# EAGLE design untitled (EAGLE 4.16)
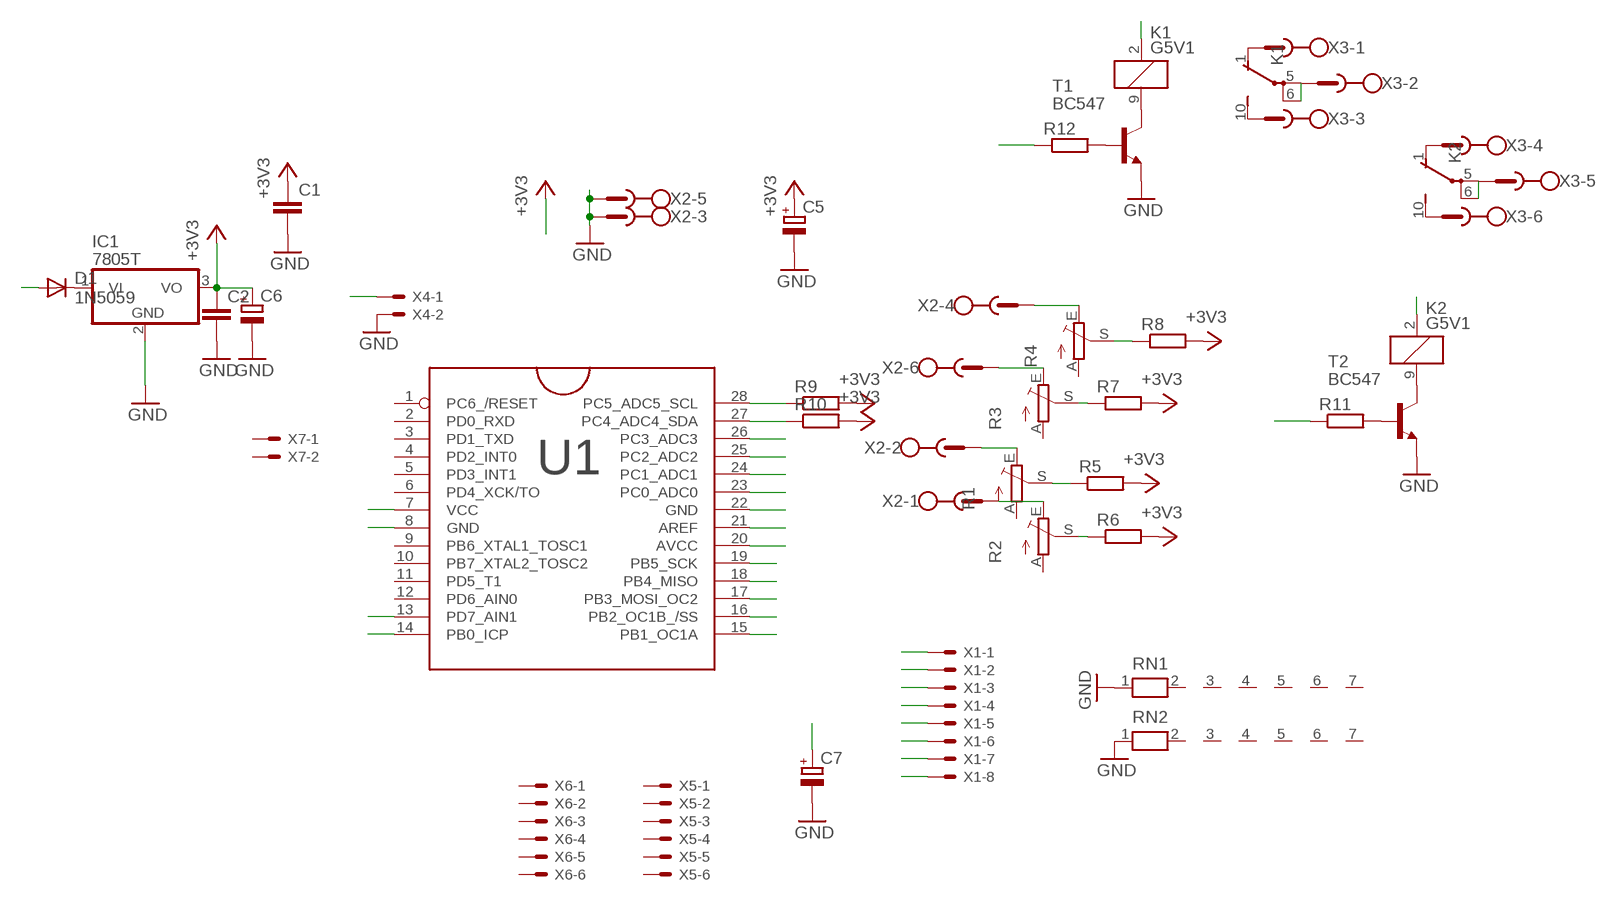
[diagram p0: schematic, sheet 1]

## Parts
C1  C-EU050-024X044  [C050-024X044]
C2  C-EU050-024X044  [C050-024X044]
C5  CPOL-EUE2.5-7  [E2,5-7]
C6  CPOL-EUE2.5-7  [E2,5-7]
C7  CPOL-EUE2.5-7  [E2,5-7]
D1  1N5059  [DO204-10]
IC1  7805T  [TO220H]
K1  G5V1  [G5V1]
K2  G5V1  [G5V1]
R1  TRIM_EU-S63X  [S63X]
R2  TRIM_EU-S63X  [S63X]
R3  TRIM_EU-S63X  [S63X]
R4  TRIM_EU-S63X  [S63X]
R5  R-EU_M0805  [M0805]
R6  R-EU_M0805  [M0805]
R7  R-EU_M0805  [M0805]
R8  R-EU_M0805  [M0805]
R9  R-EU_M0805  [M0805]
R10  R-EU_M0805  [M0805]
R11  R-EU_M0805  [M0805]
R12  R-EU_M0805  [M0805]
RN1  RN06  [RN-7]
RN2  RN06  [RN-7]
T1  BC547  [TO92]
T2  BC547  [TO92]
U1  ATMEGA8_PDIP28_PDIP  [DIL-28-3]
X1  22-23-2081  [22-23-2081]
X2  RIA182-06  [RIA182-06]
X3  RIA182-06  [RIA182-06]
X4  22-23-2021  [22-23-2021]
X5  22-23-2061  [22-23-2061]
X6  22-23-2061  [22-23-2061]
X7  22-23-2021  [22-23-2021]

## Nets
+3V3: C1.1 C2.1 C5.+ C6.+ IC1.3(VO) R5.2 R6.2 R7.2 R8.2 R9.2 R10.2 U1.7(VCC) U1.20(AVCC) U1.21(AREF) X1.1
ADC0: R2.E U1.23(PC0_ADC0) X2.1
ADC1: R1.E U1.24(PC1_ADC1) X2.2
ADC2: R4.E U1.25(PC2_ADC2) X2.4
ADC3: R3.E U1.26(PC3_ADC3) X2.6
DC: U1.15(PB1_OC1A) X1.4
ENA: U1.16(PB2_OC1B_/SS) X1.5
GND: C1.2 C2.2 C5.- C6.- C7.- IC1.2(GND) RN1.1 RN2.1 T1.1(E) T2.1(E) U1.8(GND) U1.22(GND) X1.6 X2.3 X2.5 X4.2
N$1: R1.S R5.1
N$2: R2.S R6.1
N$3: R3.S R7.1
N$4: R4.S R8.1
N$5: D1.C IC1.1(VI)
N$6: K1.1(2:O) X3.1
N$7: K1.5(2:P) K1.6(2:P) X3.2
N$8: K1.10(2:S) X3.3
N$9: K2.1(2:O) X3.4
N$11: K2.5(2:P) K2.6(2:P) X3.5
N$12: K2.10(2:S) X3.6
N$13: R9.1 U1.28(PC5_ADC5_SCL)
N$14: R10.1 U1.27(PC4_ADC4_SDA)
N$15: K1.9 T1.3(C)
N$16: K2.9 T2.3(C)
N$17: R11.2 T2.2(B)
N$18: R12.2 T1.2(B)
POW: D1.A K1.2 K2.2 X4.1
REL1: R12.1 U1.14(PB0_ICP)
REL2: R11.1 U1.13(PD7_AIN1)
RES: U1.18(PB4_MISO) X1.8
SCK: U1.19(PB5_SCK) X1.2
SDIN: U1.17(PB3_MOSI_OC2) X1.3
VOUT: C7.+ X1.7
Unconnected: R1.A R2.A R3.A R4.A RN1.2 RN1.3 RN1.4 RN1.5 RN1.6 RN1.7 RN2.2 RN2.3 RN2.4 RN2.5 RN2.6 RN2.7 U1.1(PC6_/RESET) U1.2(PD0_RXD) U1.3(PD1_TXD) U1.4(PD2_INT0) U1.5(PD3_INT1) U1.6(PD4_XCK/TO) U1.9(PB6_XTAL1_TOSC1) U1.10(PB7_XTAL2_TOSC2) U1.11(PD5_T1) U1.12(PD6_AIN0) X5.1 X5.2 X5.3 X5.4 X5.5 X5.6 X6.1 X6.2 X6.3 X6.4 X6.5 X6.6 X7.1 X7.2

## Library data of the parts
C1 C2 = rcl:C-EU: CAPACITOR, European symbol
C5-C7 = rcl:CPOL-EU: POLARIZED CAPACITOR, European symbol
D1 = diode:1N5059: DIODE controlled avalanche rectifier
IC1 = linear:78*: Positive VOLTAGE REGULATOR Source: http://cache.national.com/ds/LM/LM78L05.pdf http://www.fairchildsemi.com/ds/LM/LM7805.pdf
K1 K2 = relay:G5V1: RELAY 1 x switch, 0.5 A/125 V AC, 1 A/24 V DC , Omron
R1-R4 = pot:TRIM_EU-: POTENTIOMETER
R5-R12 = rcl:R-EU_: RESISTOR, European symbol
RN1 RN2 = resistor-net:RN06: RESISTOR NETWORK
T1 T2 = transistor:BC547: NPN TRANSISTOR
U1 = atmel_prototype_header:ATMEGA8_PDIP28: ATMEL 8-bit AVR Microcontroller with 8K Bytes In-System Programmable Flash.
X1 = con-molex:22-23-2081: .100" (2.54mm) Center Header - 8 Pin
X2 X3 = con-ria182:RIA182-06: Gewinkelter Wannenstecker 6-polig Rastermaß: 3,5mm Lötstift / Steckerstift: 1x1mm Bohrung: 1,5mm Bemessungsstrom: 5A Nennquerschnitt Stecker: 1,5qmm eindrähtig / 1qmm feinstdrähtig
X4 X7 = con-molex:22-23-2021: .100" (2.54mm) Center Header - 2 Pin
X5 X6 = con-molex:22-23-2061: .100" (2.54mm) Center Header - 6 Pin

## Board
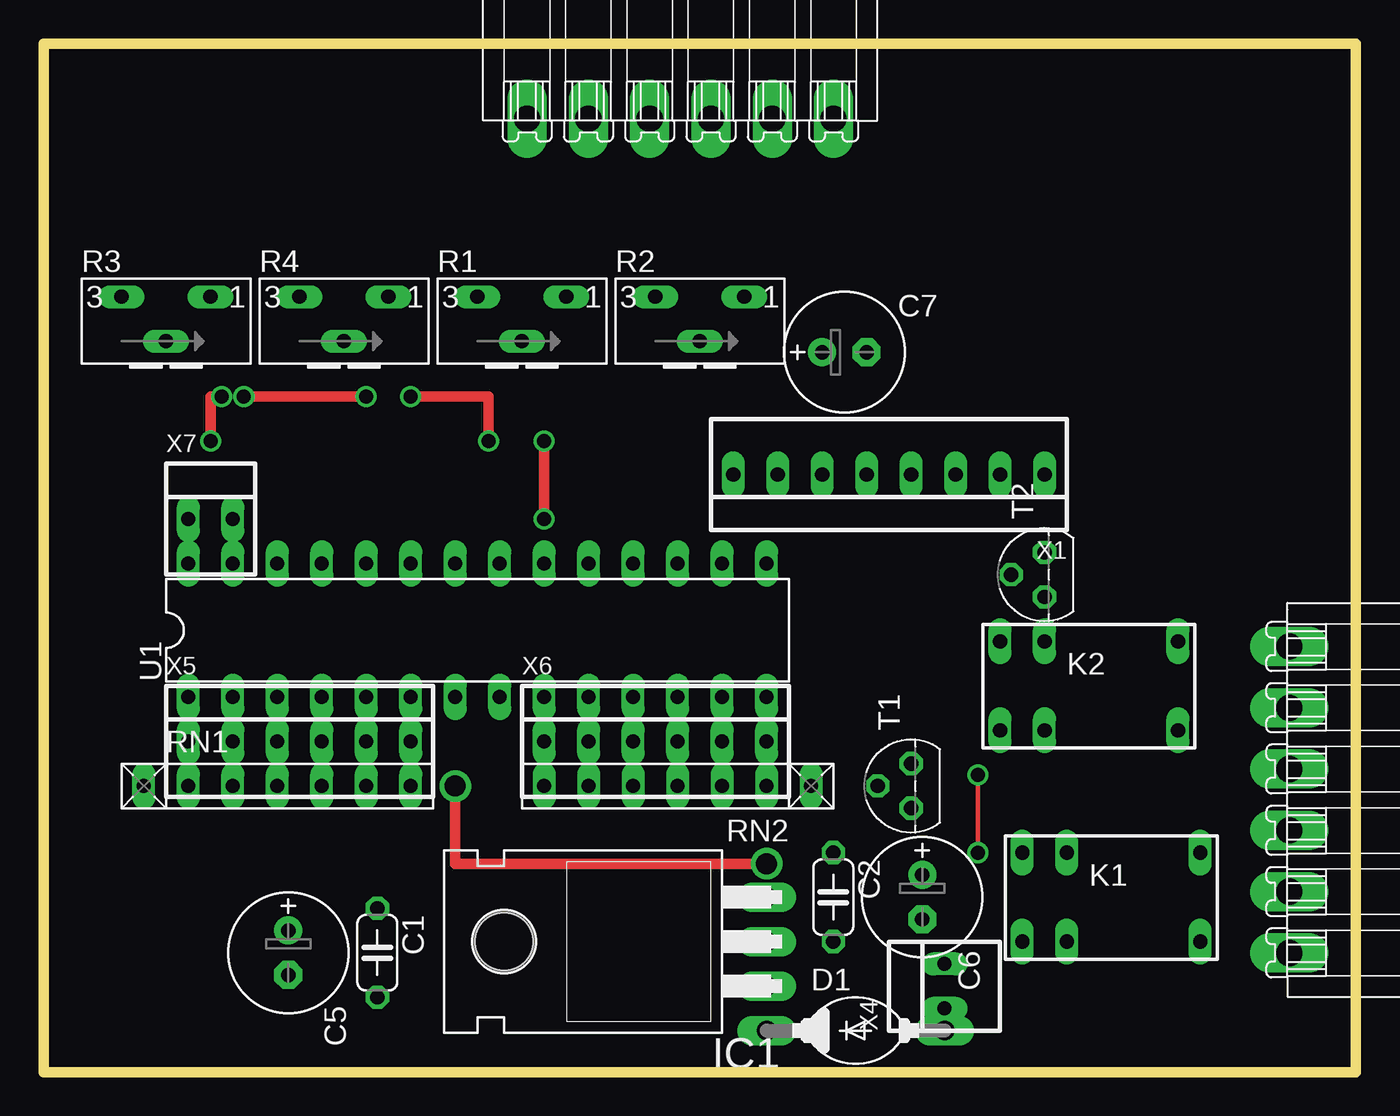
[diagram p1: board, top side]
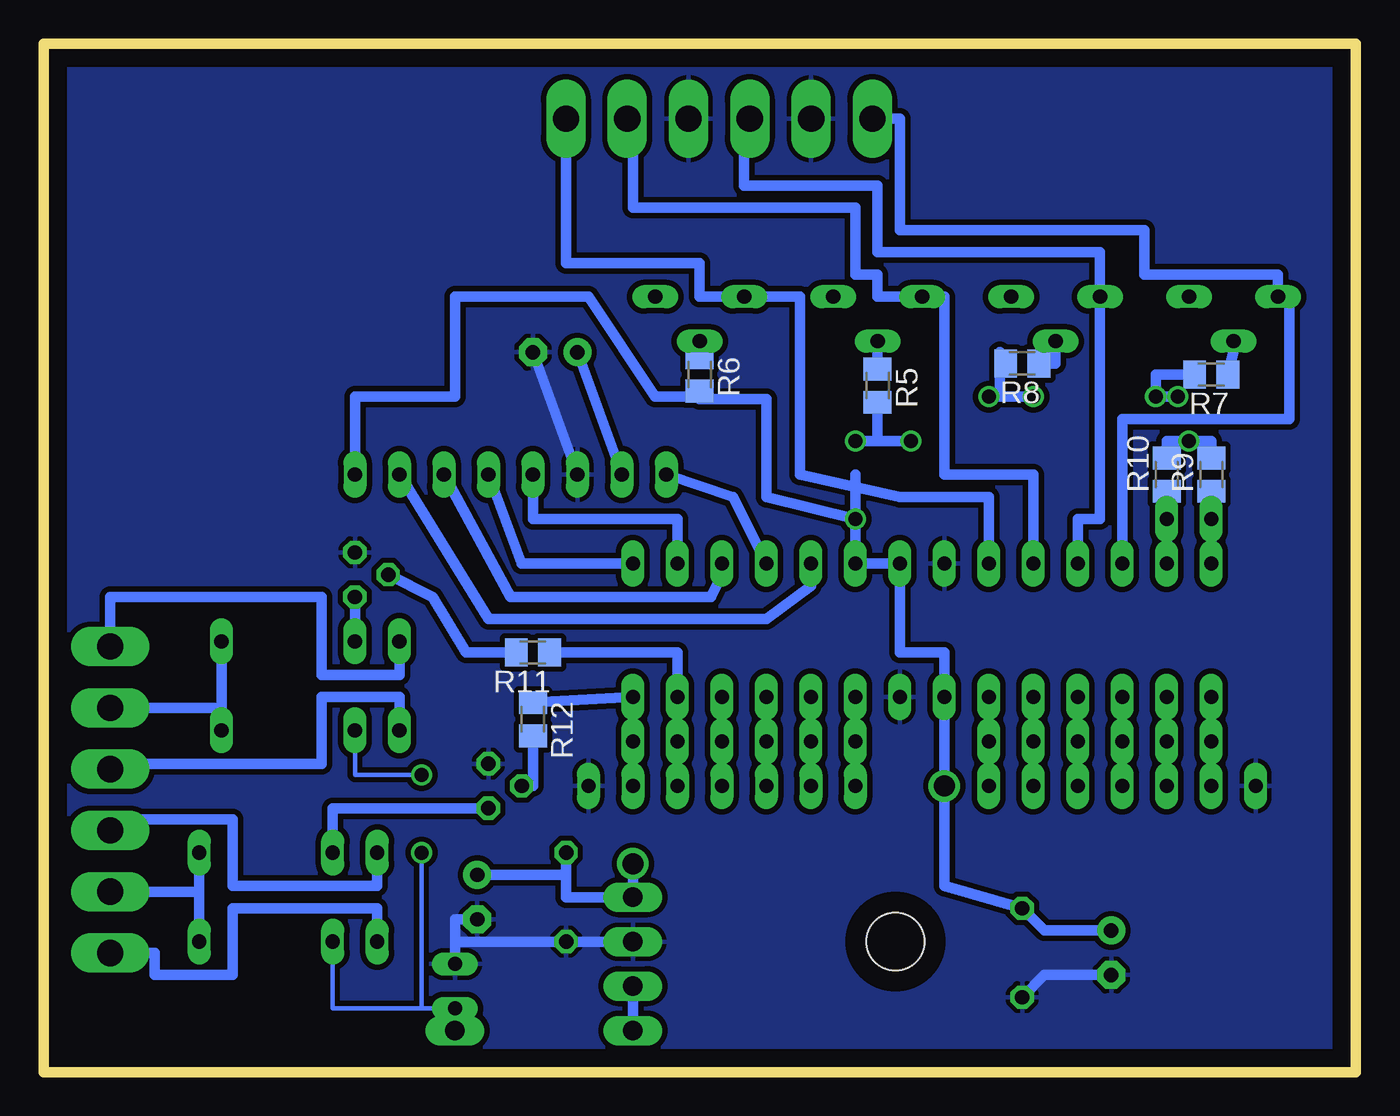
[diagram p2: board, bottom side, seen from below]

Size 74.91 x 58.73 mm. Coordinates in mm from the lower left corner, seen from the top.
Outline: 0,0 74.91,0 74.91,58.73 0,58.73 0,0
Copper layers (1*16): Top 0.035mm / dielectric 1.5mm / Bottom 0.035mm
Design rules "default": minimum track width 10mil, minimum drill 24mil, track to track 8mil, track to pad 8mil, pad to pad 8mil, via to via 8mil, smd to smd 8mil, copper to edge 40mil, drill to drill 8mil, minimum pad ring 10mil, minimum via ring 8mil, stop-mask expansion 4mil, vias tented up to drill 0mil, thermal gap 10mil

### Footprints (pad centres in the part's own frame; a part is rotated, then mirrored left to right if it is on the bottom)
C050-024X044 = drill 0.813 octagon: 1 -2.54,0; 2 2.54,0
E2,5-7 = drill 0.813 pad 1.6 round: + -1.27,0 | drill 0.813 pad 1.6 octagon: - 1.27,0
DO204-10 = drill 1.118 long: A 5.08,0; C -5.08,0
TO220H = drill 1.118 long: 1 -2.54,-10.16; 2 0,-10.16; 3 2.54,-10.16 | hole 3.302: 0,4.826
G5V1 = drill 0.813 long: 1 -5.08,-2.54; 2 -2.54,-2.54; 5 5.08,-2.54; 6 5.08,2.54; 9 -2.54,2.54; 10 -5.08,2.54
S63X = drill 0.813 long: A 2.54,0; E -2.54,0; S 0,-2.54
M0805 = smd 1.3 x 1.6: 1 -0.95,0; 2 0.95,0
RN-7 = drill 0.813 long: 1 -7.62,0; 2 -5.08,0; 3 -2.54,0; 4 0,0; 5 2.54,0; 6 5.08,0; 7 7.62,0
TO92 = drill 0.813 octagon: 1 1.27,0; 2 0,1.905; 3 -1.27,0
DIL-28-3 = drill 0.813 pad 1.321 long: 1 -16.51,-3.81; 2 -13.97,-3.81; 3 -11.43,-3.81; 4 -8.89,-3.81; 5 -6.35,-3.81; 6 -3.81,-3.81; 7 -1.27,-3.81; 8 1.27,-3.81; 9 3.81,-3.81; 10 6.35,-3.81; 11 8.89,-3.81; 12 11.43,-3.81; 13 13.97,-3.81; 14 16.51,-3.81; 15 16.51,3.81; 16 13.97,3.81; 17 11.43,3.81; 18 8.89,3.81; 19 6.35,3.81; 20 3.81,3.81; 21 1.27,3.81; 22 -1.27,3.81; 23 -3.81,3.81; 24 -6.35,3.81; 25 -8.89,3.81; 26 -11.43,3.81; 27 -13.97,3.81; 28 -16.51,3.81
22-23-2081 = drill 0.813 long: 1 -8.89,0; 2 -6.35,0; 3 -3.81,0; 4 -1.27,0; 5 1.27,0; 6 3.81,0; 7 6.35,0; 8 8.89,0
RIA182-06 = drill 1.5 long: 1 -7,0; 2 -3.5,0; 3 0,0; 4 3.5,0; 5 7,0; 6 10.5,0
22-23-2021 = drill 0.813 long: 1 -1.27,0; 2 1.27,0
22-23-2061 = drill 0.813 long: 1 -6.35,0; 2 -3.81,0; 3 -1.27,0; 4 1.27,0; 5 3.81,0; 6 6.35,0

### Placement (x,y rotation side)
C1  19.04,6.82 270 top
C2  45.08,9.99 270 top
C5  13.96,6.82 270 top
C6  50.16,9.99 270 top
C7  45.71,41.11 0 top
D1  46.35,2.38 0 top
IC1  31.11,7.46 90 top
K1  60.95,9.99 0 top
K2  59.69,22.06 0 top
R1  27.3,44.29 0 top
R2  37.46,44.29 0 top
R3  6.98,44.29 0 top
R4  17.14,44.29 0 top
R5  27.3,39.21 270 bottom
R6  37.46,39.84 270 bottom
R7  8.25,39.84 180 bottom
R8  19.04,40.48 180 bottom
R9  8.25,34.12 90 bottom
R10  10.79,34.12 90 bottom
R11  46.98,23.96 180 bottom
R12  46.98,20.15 270 bottom
RN1  13.33,16.34 0 top
RN2  36.19,16.34 180 top
T1  49.52,16.34 90 top
T2  57.14,28.41 90 top
U1  24.76,25.23 0 top
X1  48.26,34.12 180 top
X2  38.09,54.45 180 top
X3  71.11,13.8 90 top
X4  51.43,4.92 90 top
X5  14.6,18.88 0 top
X6  34.92,18.88 0 top
X7  9.52,31.58 0 top

### Tracks (layer width: path | path; a pad name or v marks a point on that pad's centre or on a via)
+3V3  (via drill 0.8, 1.2)
  Top 0.61: v18.41,38.57 v11.42,38.57 | v20.95,38.57 25.39,38.57 v25.39,36.03 | v28.57,31.58 v28.57,36.03 | v10.15,38.57 9.52,38.57 v9.52,36.03 | v23.49,16.34 23.49,11.9 v41.27,11.9
  Bottom 0.61: v28.57,31.58 33.65,32.86 33.65,38.44 37.46,38.44 37.46,38.57 | v28.57,31.58 U1.20 U1.21 26.03,23.96 23.49,23.96 U1.7 23.49,10.63 | v28.57,31.58 28.57,34.12 | v28.57,31.58 28.57,34.12 | C5.+ 17.77,8.09 C1.1 23.49,10.63 | C6.+ 45.08,11.26 C2.1 45.08,9.99 IC1.3 v41.27,11.9 | R7.2 11.42,39.84 v11.42,38.57 v10.15,38.57 | 20.31,38.57 v18.41,38.57 | 20.31,41.11 R8.2 20.31,41.11 | 20.31,38.57 20.31,41.11 | 20.31,38.57 20.31,41.11 | v20.95,38.57 20.31,38.57 | R5.2 27.3,38.57 27.3,36.03 | 27.3,36.03 v25.39,36.03 | v28.57,36.03 27.3,36.03 | v28.57,31.58 28.57,34.12 | 37.46,38.57 R6.2 37.46,38.57 | X1.1 57.14,38.57 51.43,38.57 51.43,44.29 43.81,44.29 40,38.57 37.46,38.57 | R9.2 8.25,36.03 v9.52,36.03 10.79,36.03 R10.2 | 23.49,10.63 v23.49,16.34
ADC0
  Bottom 0.61: U1.23 20.95,32.86 26.03,32.86 31.74,34.12 31.74,44.29 R2.E 37.46,44.29 37.46,46.19 45.08,46.19 X2.1
ADC1
  Bottom 0.61: U1.24 18.41,34.12 23.49,34.12 23.49,44.29 R1.E 27.3,44.29 27.3,45.55 28.57,45.55 28.57,49.37 41.27,49.37 41.27,50 41.27,54.45 X2.2
ADC2
  Bottom 0.61: U1.25 15.87,31.58 14.6,31.58 R4.E 14.6,46.83 27.3,46.83 27.3,50.64 34.92,50.64 34.92,54.45 X2.4
ADC3
  Bottom 0.61: U1.26 13.33,37.3 3.81,37.3 3.81,44.29 R3.E 4.44,45.55 12.06,45.55 12.06,48.1 26.03,48.1 26.03,54.45 X2.6
DC
  Bottom 0.61: U1.15 47.62,29.04 X1.4
ENA
  Bottom 0.61: U1.16 38.73,31.58 40,31.58 46.98,31.58 X1.5
GND
  Bottom 0.61: X1.6 C7.- | C5.- 17.77,5.55 C1.2 | IC1.2 C2.2 51.43,7.46 X4.2 51.43,8.72 C6.-
  pour Bottom (isolate 0.305): -4.45,-3.34 -4.45,64.61 76.83,64.61 78.73,-3.34
N$1
  Bottom 0.61: R1.S R5.1
N$2
  Bottom 0.61: R6.1 37.46,41.11 R2.S
N$3
  Bottom 0.61: R7.1 6.98,41.11 R3.S
N$4
  Bottom 0.61: R8.1 17.14,40.48 R4.S
N$5
  Bottom 0.61: D1.C IC1.1
N$6
  Bottom 0.61: K1.1 55.88,9.36 64.13,9.36 64.13,5.55 68.58,5.55 68.58,6.82 X3.1
N$7
  Bottom 0.61: K1.5 66.03,9.99 | 66.03,9.99 K1.6 | X3.2 66.03,10.3 66.03,9.99
N$8
  Bottom 0.61: K1.10 55.88,10.63 64.13,10.63 64.13,14.44 71.11,14.44 X3.3
N$9
  Bottom 0.61: K2.1 54.6,21.43 59.05,21.43 59.05,17.61 71.11,17.61 X3.4
N$11
  Bottom 0.61: K2.5 64.77,20.79 | 64.77,20.79 K2.6 | X3.5 64.77,20.8 64.77,20.79
N$12
  Bottom 0.61: K2.10 54.6,22.7 59.05,22.7 59.05,27.14 71.11,27.14 71.11,24.6 X3.6
N$13
  Bottom 0.61: R9.1 8.25,33.49 U1.28
N$14
  Bottom 0.61: R10.1 10.79,33.49 U1.27
N$15
  Bottom 0.61: T1.3 58.41,15.07 K1.9
N$16
  Bottom 0.61: K2.9 T2.3
N$17
  Bottom 0.61: T2.2 52.7,27.14 50.8,23.96 48.26,23.96 R11.2
N$18
  Bottom 0.61: R12.2 46.98,18.25 46.98,16.34 T1.2
POW  (via drill 0.8)
  Top 0.254: v53.34,12.54 v53.34,16.98
  Bottom 0.254: X4.1 53.34,3.65 | 53.34,3.65 58.41,3.65 K1.2 | K2.2 57.14,16.98 v53.34,16.98 | v53.34,12.54 53.34,11.9 53.34,3.65
  Bottom 0.61: X4.1 D1.A
REL1
  Bottom 0.61: U1.14 R12.1
REL2
  Bottom 0.61: R11.1 38.73,23.96 U1.13
RES
  Bottom 0.61: X1.8 35.55,32.86 U1.18
SCK
  Bottom 0.61: U1.19 31.11,27.77 33.65,25.87 49.52,25.87 X1.2
SDIN
  Bottom 0.61: U1.17 36.19,28.41 36.83,27.14 48.26,27.14 X1.3
VOUT
  Bottom 0.61: X1.7 C7.+